# Altium schematic sheet General Overview.SchDoc: Sheetname
size A4; Organization: Overload, Inc.; Address1: Robbe Van Assche; Address2: Belgium; Address3: 2013; Address4: SE - Carnaval kleding REV B; DocumentNumber: 1; Revision: B; SheetNumber: ALT0056; SheetTotal: 21; PageSetup: Record=PageOptions|CenterHorizontal=True|CenterVertical=True|PrintScale=1.72|XCorrection=1.00|YCorrection=1.00|PrintKind=1|BorderSize=5000000|LeftOffset=0|BottomOffset=0|Orientation=2|PaperLength=1000|PaperWidth=1000|Scale=100|PaperSource=7|PrintQuality=-3|MediaType=1|DitherType=10|PrintScaleMode=1|PaperKind=A4|PaperIndex=9
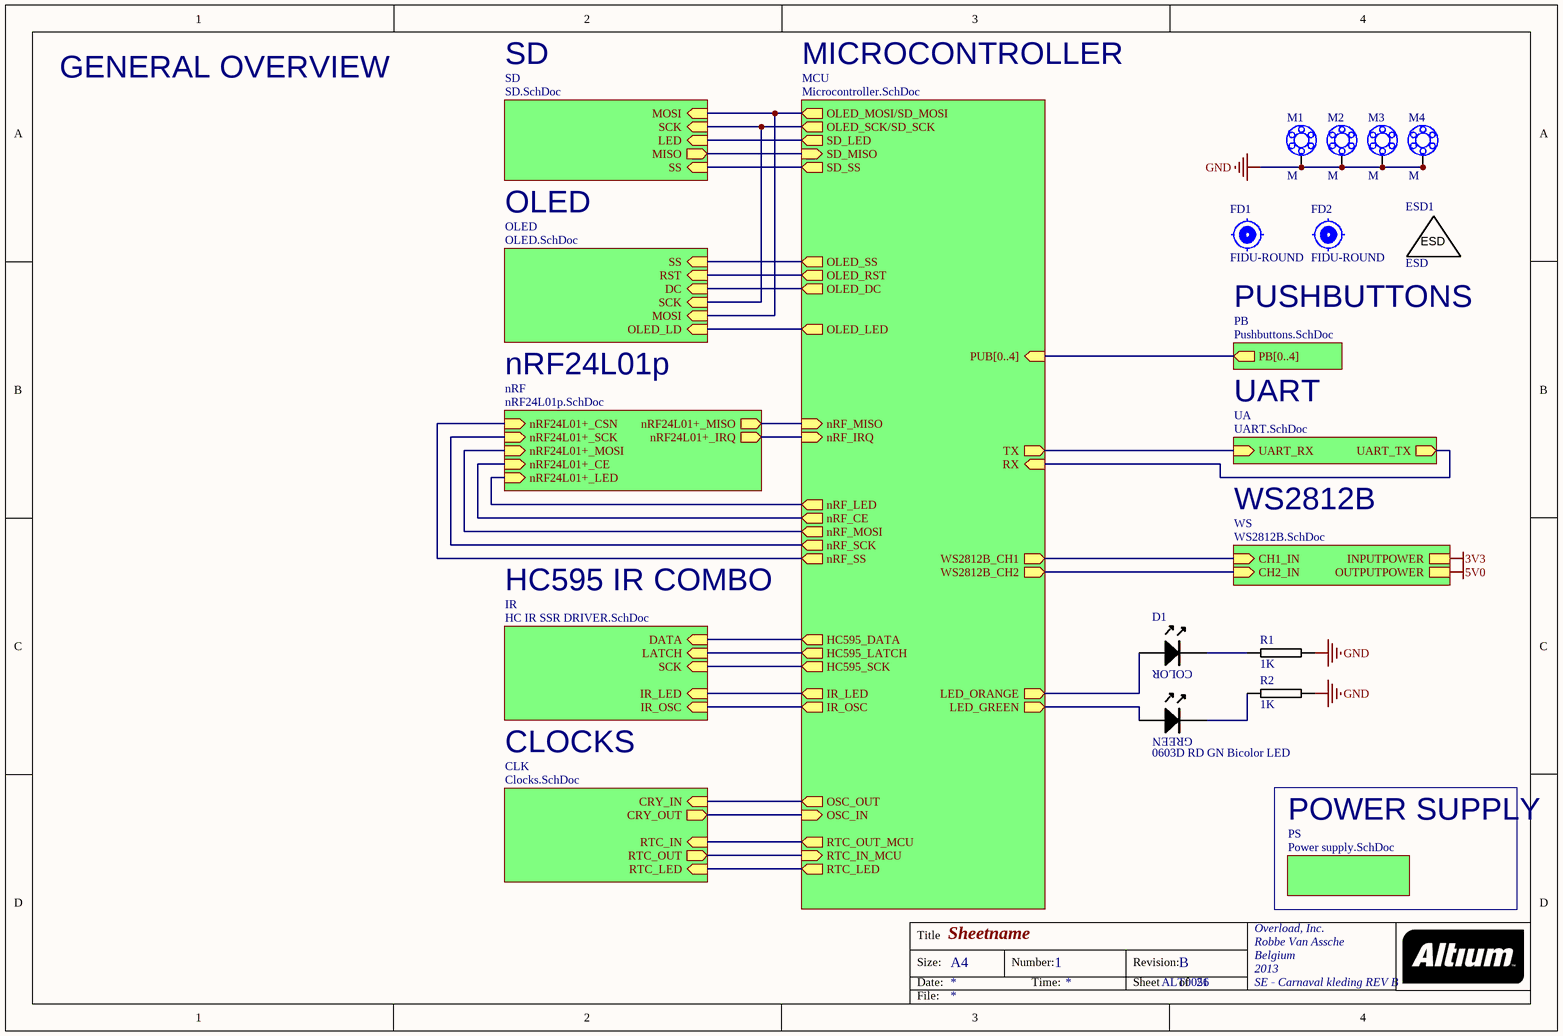
[diagram p0: General Overview.SchDoc]

## Parts
D1  0603D RD GN Bicolor LED  [0606LED BiCOLOR]
ESD1  ESD  [ESDSILK]  (no BOM)
FD1  FIDU-ROUND  [FIDU-ROUND]  (no BOM)
FD2  FIDU-ROUND  [FIDU-ROUND]  (no BOM)
M1  M  [MOUNTING]  (no BOM)
M2  M  [MOUNTING]  (no BOM)
M3  M  [MOUNTING]  (no BOM)
M4  M  [MOUNTING]  (no BOM)
R1  1K  [0603R-1k]
R2  1K  [0603R-1k]

## Sub-sheets
CLK = Clocks.SchDoc: RTC_IN (in), RTC_OUT (out), RTC_LED (in), CRY_IN (in), CRY_OUT (out)
IR = HC IR SSR DRIVER.SchDoc: SCK (in), LATCH (in), DATA (in), IR_OSC (in), IR_LED (in)
MCU = Microcontroller.SchDoc: RTC_LED (out), RTC_IN_MCU (in), RTC_OUT_MCU (out), OSC_IN (in), OSC_OUT (out), OLED_LED (out), SD_LED (out), TX (out), RX (in), SD_SS (out), OLED_SCK/SD_SCK (out), SD_MISO (in), OLED_MOSI/SD_MOSI (out), OLED_RST (out), OLED_DC (out), nRF_IRQ (in), nRF_CE (out), nRF_LED (out), nRF_SS (out), nRF_SCK (out), nRF_MISO (in), nRF_MOSI (out), WS2812B_CH1 (out), WS2812B_CH2 (out), OLED_SS (out), IR_LED (out), IR_OSC (out), HC595_DATA (out), HC595_LATCH (out), HC595_SCK (out), LED_GREEN (out), LED_ORANGE (out), PUB[0..4] (in)
nRF = nRF24L01p.SchDoc: nRF24L01+_CSN (in), nRF24L01+_SCK (in), nRF24L01+_MISO (out), nRF24L01+_MOSI (in), nRF24L01+_IRQ (out), nRF24L01+_CE (in), nRF24L01+_LED (in)
OLED = OLED.SchDoc: SS (in), RST (in), DC (in), SCK (in), MOSI (in), OLED_LD (in)
PB = Pushbuttons.SchDoc: PB[0..4] (out)
PS = Power supply.SchDoc: no entries
SD = SD.SchDoc: MOSI (in), SCK (in), MISO (out), SS (in), LED (in)
UA = UART.SchDoc: UART_RX (in), UART_TX (out)
WS = WS2812B.SchDoc: CH1_IN (in), CH2_IN (in), INPUTPOWER, OUTPUTPOWER

## Nets
3V3: sheet WS/INPUTPOWER
5V0: sheet WS/OUTPUTPOWER
GND: M1.1 M1.2 M1.3 M1.4 M1.5 M1.6 M1.7 M2.1 M2.2 M2.3 M2.4 M2.5 M2.6 M2.7 M3.1 M3.2 M3.3 M3.4 M3.5 M3.6 M3.7 M4.1 M4.2 M4.3 M4.4 M4.5 M4.6 M4.7 R1.2 R2.2
NetD1_A1: D1.A1 ; sheet MCU/LED_GREEN
NetD1_A2: D1.A2 ; sheet MCU/LED_ORANGE
NetD1_K1: D1.K1 R2.1
NetD1_K2: D1.K2 R1.1
(unnamed): sheet WS/CH1_IN, sheet MCU/WS2812B_CH1
(unnamed): sheet WS/CH2_IN, sheet MCU/WS2812B_CH2
(unnamed): sheet MCU/RTC_LED, sheet CLK/RTC_LED
(unnamed): sheet MCU/RTC_IN_MCU, sheet CLK/RTC_OUT
(unnamed): sheet MCU/RTC_OUT_MCU, sheet CLK/RTC_IN
(unnamed): sheet MCU/OSC_IN, sheet CLK/CRY_OUT
(unnamed): sheet MCU/OSC_OUT, sheet CLK/CRY_IN
(unnamed): sheet MCU/OLED_LED, sheet OLED/OLED_LD
(unnamed): sheet MCU/SD_LED, sheet SD/LED
(unnamed): sheet MCU/TX, sheet UA/UART_RX
(unnamed): sheet MCU/RX, sheet UA/UART_TX
(unnamed): sheet MCU/SD_SS, sheet SD/SS
(unnamed): sheet MCU/OLED_SCK/SD_SCK, sheet SD/SCK, sheet OLED/SCK
(unnamed): sheet MCU/SD_MISO, sheet SD/MISO
(unnamed): sheet MCU/OLED_MOSI/SD_MOSI, sheet SD/MOSI, sheet OLED/MOSI
(unnamed): sheet MCU/OLED_RST, sheet OLED/RST
(unnamed): sheet MCU/OLED_DC, sheet OLED/DC
(unnamed): sheet MCU/nRF_IRQ, sheet nRF/nRF24L01+_IRQ
(unnamed): sheet MCU/nRF_CE, sheet nRF/nRF24L01+_CE
(unnamed): sheet MCU/nRF_LED, sheet nRF/nRF24L01+_LED
(unnamed): sheet MCU/nRF_SS, sheet nRF/nRF24L01+_CSN
(unnamed): sheet MCU/nRF_SCK, sheet nRF/nRF24L01+_SCK
(unnamed): sheet MCU/nRF_MISO, sheet nRF/nRF24L01+_MISO
(unnamed): sheet MCU/nRF_MOSI, sheet nRF/nRF24L01+_MOSI
(unnamed): sheet MCU/OLED_SS, sheet OLED/SS
(unnamed): sheet MCU/IR_LED, sheet IR/IR_LED
(unnamed): sheet MCU/IR_OSC, sheet IR/IR_OSC
(unnamed): sheet MCU/HC595_DATA, sheet IR/DATA
(unnamed): sheet MCU/HC595_LATCH, sheet IR/LATCH
(unnamed): sheet MCU/HC595_SCK, sheet IR/SCK

## Buses and harness runs
bus sheet MCU/PUB[0..4] = sheet PB/PB[0..4]

## Notes on the sheet
- GENERAL OVERVIEW
- SD
- MICROCONTROLLER
- OLED
- PUSHBUTTONS
- nRF24L01p
- UART
- WS2812B
- HC595 IR COMBO
- CLOCKS
- POWER SUPPLY
- Title
- Size:
- Date:
- A4
- Number:
- Time:
- Revision:
- Sheet
- of
- File:
- (in symbol 0603D RD GN Bicolor LED) COLOR; GREEN

## Library data of the parts
D1 = 0603D RD GN Bicolor LED: Bicolor 0603 LED
ESD1 = ESD: ESD LOGO
FD1 FD2 = FIDU-ROUND: ROUND FIDUCIAL
M1-M4 = MOUNTING: MOUNTING HOLE - NON INSTALLABLE
R1 R2 = 0603R-1K: GENERIC RESISTOR 0603; Manufacturer Part Number: RMCF 1/16 1K 1% R; Manufacturer: Stackpole Electronics Inc; Reel: R14; Supplier 1: Digi-Key; Supplier Part Number 1: RMCF0603FT1K00TR-ND